# Altium project DE-130817.PrjPcb (part 1 of 2)
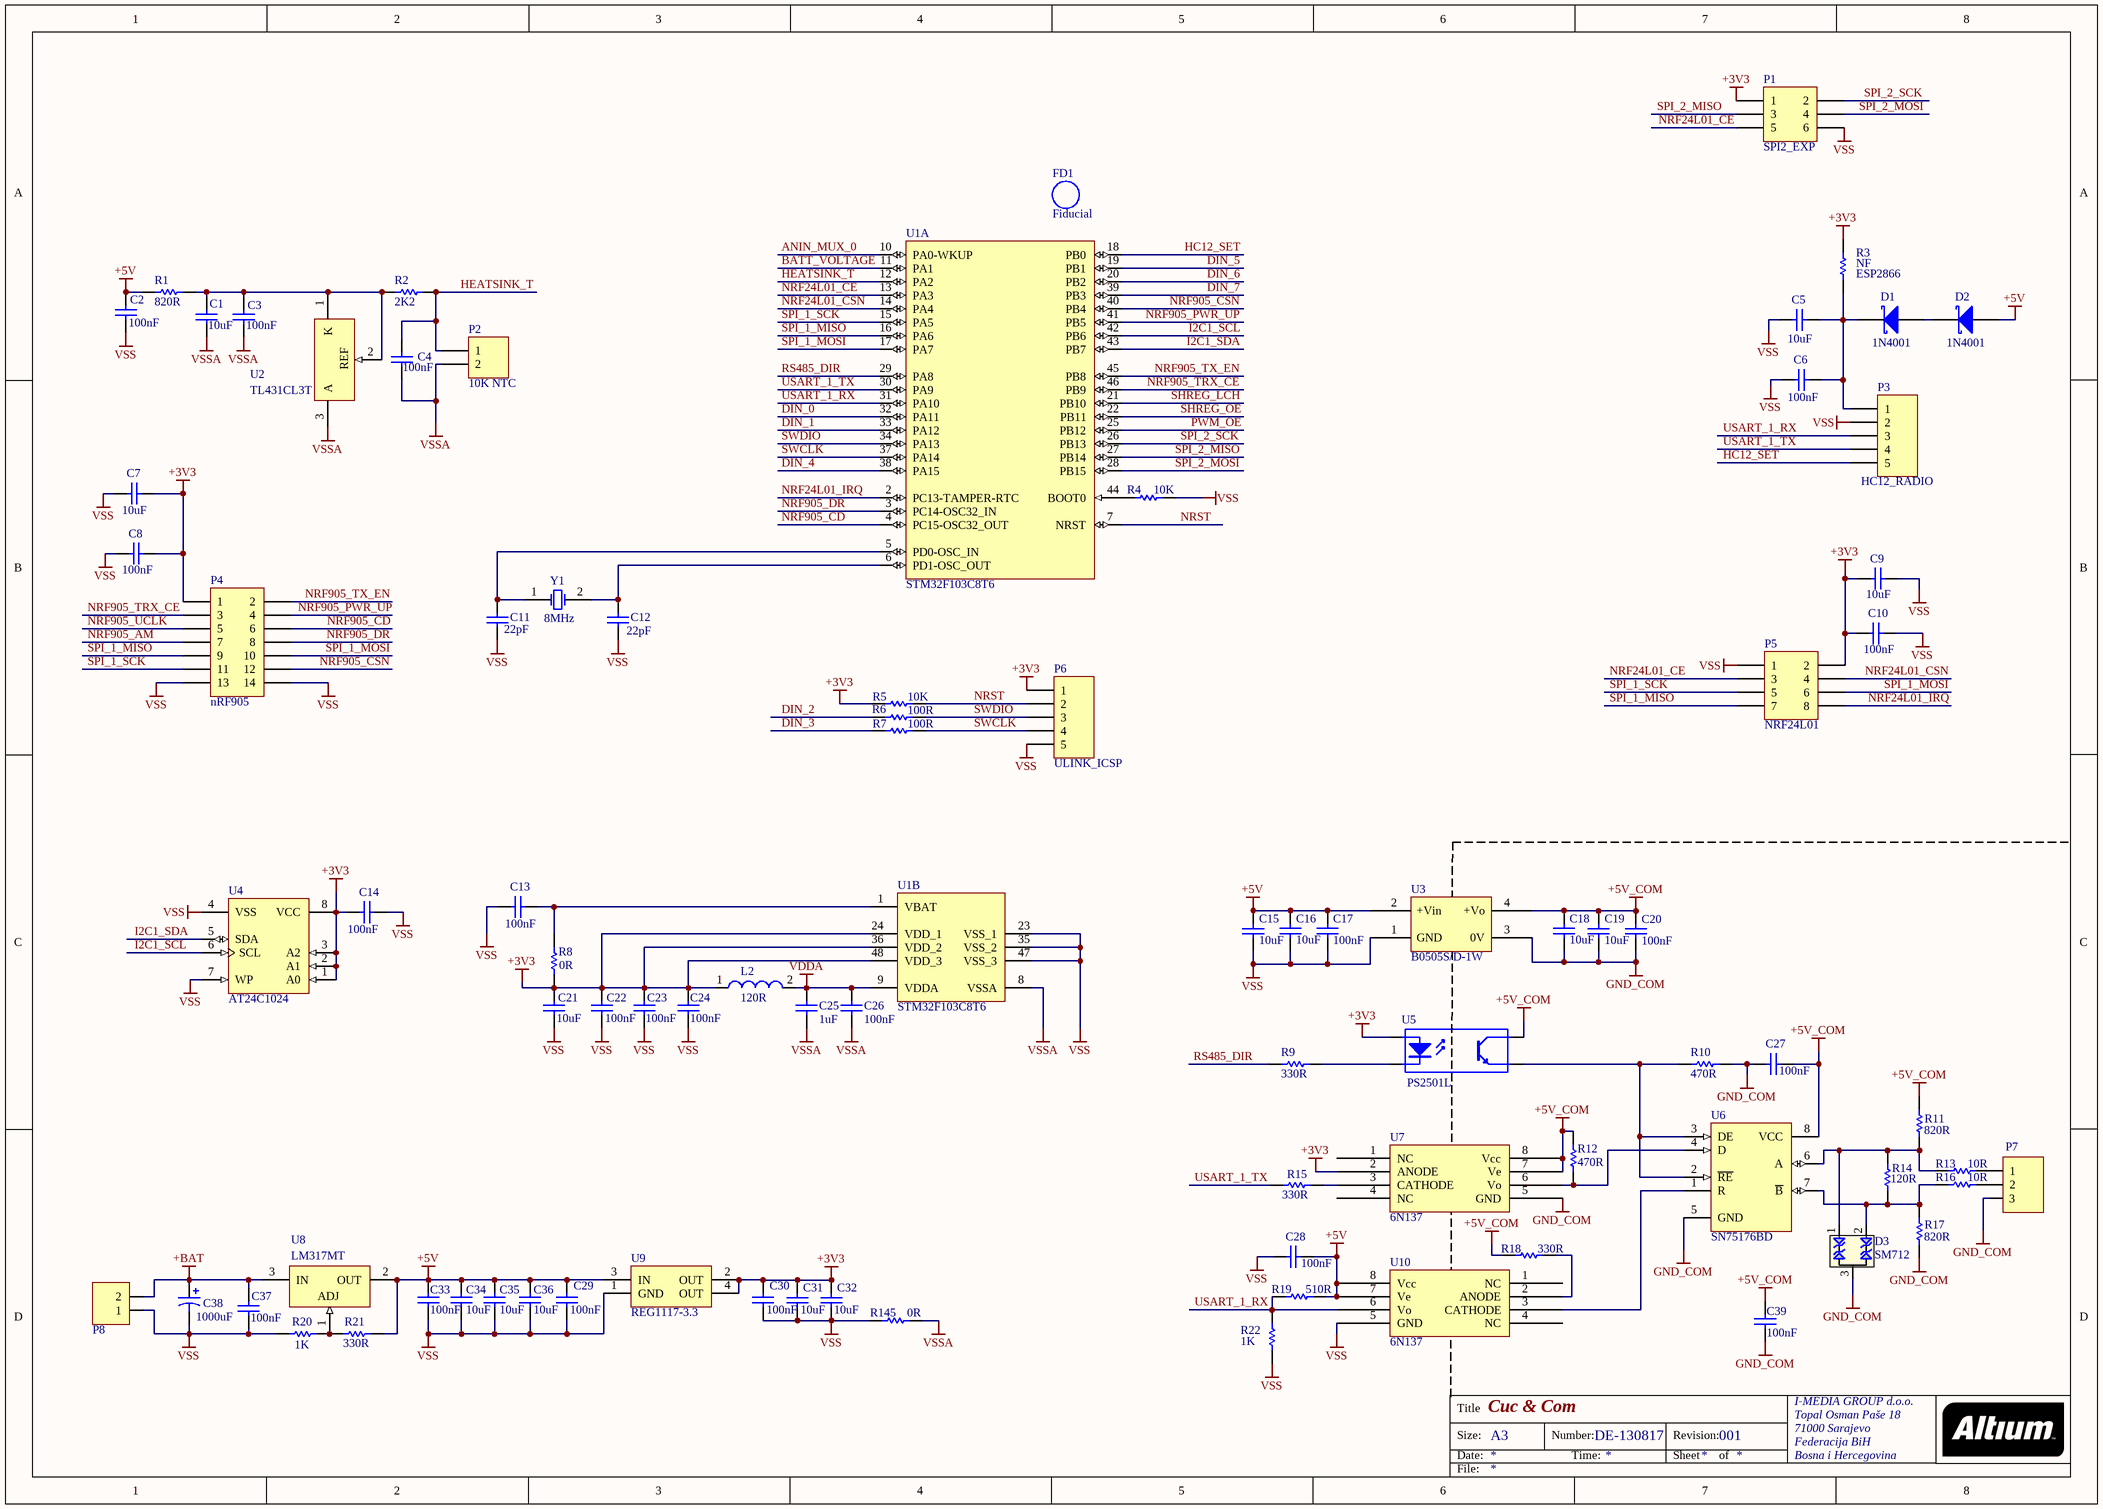
[diagram p0: DE-130817_01.SchDoc]
3 sheets, 405 parts. Net scope: global (net labels, ports and power ports of the same name join across sheets).
Board file: DE-130817.PcbDoc
Sheets:
  DE-130817_01.SchDoc
  DE-130817_02.SchDoc
  DE-130817_03.SchDoc

## Sheet DE-130817_01.SchDoc: Cuc & Com
size A3; Author: eldar6776@hotmail.com; DrawnBy: Eldar Dedic; Organization: I-MEDIA GROUP d.o.o.; Address1: Topal Osman Paše 18; Address2: 71000 Sarajevo; Address3: Federacija BiH; Address4: Bosna i Hercegovina; DocumentNumber: DE-130817; Revision: 001

### Parts
C1  10uF  [0805]
C2  100nF  [0603]
C3  100nF  [0603]
C4  100nF  [0603]
C5  10uF  [0805]
C6  100nF  [0603]
C7  10uF  [0805]
C8  100nF  [0603]
C9  10uF  [0805]
C10  100nF  [0603]
C11  22pF  [0603]
C12  22pF  [0603]
C13  100nF  [0603]
C14  100nF  [0603]
C15  10uF  [0805]
C16  10uF  [0805]
C17  100nF  [0603]
C18  10uF  [0805]
C19  10uF  [0805]
C20  100nF  [0603]
C21  10uF  [0805]
C22  100nF  [0603]
C23  100nF  [0603]
C24  100nF  [0603]
C25  1uF  [0603]
C26  100nF  [0603]
C27  100nF  [0603]
C28  100nF  [0603]
C29  100nF  [0603]
C30  100nF  [0603]
C31  10uF  [0805]
C32  10uF  [0805]
C33  100nF  [0603]
C34  10uF  [0805]
C35  10uF  [0805]
C36  10uF  [0805]
C37  100nF  [0603]
C38  1000uF  [CAPPR5-10x16]
C39  100nF  [0603]
D1  1N4001  [SMA]
D2  1N4001  [SMA]
D3  SM712  [SOT23_3L]
FD1  Fiducial  [Fiducial]  (no BOM)
L2  120R  [SMD-0805]
P1  SPI2_EXP  [HDR2X3]
P2  10K NTC  [HDR1X2]
P3  HC12_RADIO  [HDR1X5]
P4  nRF905  [HDR2X7]
P5  NRF24L01  [HDR2X4]
P6  ULINK_ICSP  [HDR1X5]
P7  TERMINAL BLOK 3  [TERMINAL BLOK 3]  (value not drawn)
P8  TERMINAL BLOK 2  [TERMINAL BLOK 2]  (value not drawn)
R1  820R  [ERA-0603]
R2  2K2  [ERA-0603]
R3  NF  [ERA-0603]
R4  10K  [ERA-0603]
R5  10K  [ERA-0603]
R6  100R  [ERA-0603]
R7  100R  [ERA-0603]
R8  0R  [ERA-0603]
R9  330R  [ERA-0603]
R10  470R  [ERA-0603]
R11  820R  [ERA-0805]
R12  470R  [ERA-0603]
R13  10R  [ERA-0805]
R14  120R  [ERA-0805]
R15  330R  [ERA-0603]
R16  10R  [ERA-0805]
R17  820R  [ERA-0805]
R18  330R  [ERA-0603]
R19  510R  [ERA-0603]
R20  1K  [ERA-0805]
R21  330R  [ERA-0805]
R22  1K  [ERA-0603]
R145  0R  [ERA-0603]
U1  STM32F103C8T6  [STM-LQFP48_N]  (parts A,B of 2)
U2  TL431CL3T  [SOT23-3_N]
U3  B0505S/D-1W  [B0505S-1W]
U4  AT24C1024  [SOIC-SN8_N]
U5  PS2501L  [SOP4]
U6  SN75176BD  [D008_L]
U7  6N137  [SMD-8]
U8  LM317MT  [221A-06]
U9  REG1117-3.3  [ZZ311]
U10  6N137  [SMD-8]
Y1  8MHz  [HC49/4H_SMX]

### Nets
+3V3: C7.1 C8.1 C9.1 C10.1 C14.1 C21.2 C22.2 C23.2 C24.2 C30.2 C31.2 C32.2 L2.1 P1.1 P4.1 P5.2 P6.1 R3.2 R5.2 R8.2 U1.24(VDD_1) U1.36(VDD_2) U1.48(VDD_3) U4.1(A0) U4.2(A1) U4.3(A2) U4.8(VCC) U5.1(A) U7.2(ANODE) U9.2(OUT) U9.4(OUT)
+5V: C2.2 C15.2 C16.2 C17.2 C28.1 C29.2 C33.2 C34.2 C35.2 C36.2 D2.1(A) R1.2 R19.1 R21.1 U3.2(+Vin) U8.2(OUT) U9.3(IN) U10.7(Ve) U10.8(Vcc)
+5V_COM: C18.2 C19.2 C20.2 C27.2 C39.1 R11.2 R12.1 R18.2 U3.4(+Vo) U5.4(C) U6.8(VCC) U7.7(Ve) U7.8(Vcc)
+BAT: C37.2 C38.1 P8.2 U8.3(IN)
GND_COM: C18.1 C19.1 C20.1 C27.1 C39.2 D3.3(GND) P7.3 R10.2 R17.1 U3.3(0V) U6.5(GND) U7.5(GND)
VDDA: C25.2 C26.2 L2.2 U1.9(VDDA)
VSS: C2.1 C5.2 C6.2 C7.2 C8.2 C9.2 C10.2 C11.1 C12.1 C13.2 C14.2 C15.1 C16.1 C17.1 C21.1 C22.1 C23.1 C24.1 C28.2 C29.1 C30.1 C31.1 C32.1 C33.1 C34.1 C35.1 C36.1 C37.1 C38.2 P1.6 P3.2 P4.13 P4.14 P5.1 P6.5 P8.1 R4.2 R20.2 R22.1 R145.1 U1.23(VSS_1) U1.35(VSS_2) U1.47(VSS_3) U3.1(GND) U4.4(VSS) U4.7(WP) U9.1(GND) U10.5(GND)
VSSA: C1.1 C3.1 C4.1 C25.1 C26.1 P2.2 R145.2 U1.8(VSSA) U2.3(A)
ANIN_MUX_0: U1.10(PA0-WKUP)
BATT_VOLTAGE: U1.11(PA1)
DIN_0: U1.32(PA11)
DIN_1: U1.33(PA12)
DIN_2: R6.2
DIN_3: R7.2
DIN_4: U1.38(PA15)
DIN_5: U1.19(PB1)
DIN_6: U1.20(PB2)
DIN_7: U1.39(PB3)
HC12_SET: P3.5 U1.18(PB0)
HEATSINK_T: C4.2 P2.1 R2.1 U1.12(PA2)
I2C1_SCL: U1.42(PB6) U4.6(SCL)
I2C1_SDA: U1.43(PB7) U4.5(SDA)
NRF24L01_CE: P1.5 P5.3 U1.13(PA3)
NRF24L01_CSN: P5.4 U1.14(PA4)
NRF24L01_IRQ: P5.8 U1.2(PC13-TAMPER-RTC)
NRF905_AM: P4.7
NRF905_CD: P4.6 U1.4(PC15-OSC32_OUT)
NRF905_CSN: P4.12 U1.40(PB4)
NRF905_DR: P4.8 U1.3(PC14-OSC32_IN)
NRF905_PWR_UP: P4.4 U1.41(PB5)
NRF905_TRX_CE: P4.3 U1.46(PB9)
NRF905_TX_EN: P4.2 U1.45(PB8)
NRF905_UCLK: P4.5
NRST: P6.2 R5.1 U1.7(NRST)
PWM_OE: U1.25(PB12)
RS485_DIR: R9.2 U1.29(PA8)
SHREG_LCH: U1.21(PB10)
SHREG_OE: U1.22(PB11)
SPI_1_MISO: P4.9 P5.7 U1.16(PA6)
SPI_1_MOSI: P4.10 P5.6 U1.17(PA7)
SPI_1_SCK: P4.11 P5.5 U1.15(PA5)
SPI_2_MISO: P1.3 U1.27(PB14)
SPI_2_MOSI: P1.4 U1.28(PB15)
SPI_2_SCK: P1.2 U1.26(PB13)
SWCLK: P6.4 R7.1 U1.37(PA14)
SWDIO: P6.3 R6.1 U1.34(PA13)
USART_1_RX: P3.3 R19.2 R22.2 U1.31(PA10) U10.6(Vo)
USART_1_TX: P3.4 R15.1 U1.30(PA9)
NetC1_2: C1.2 C3.2 R1.1 R2.2 U2.1(K) U2.2(REF)
NetC5_1: C5.1 C6.1 D1.2(K) P3.1 R3.1
NetC11_2: C11.2 U1.5(PD0-OSC_IN) Y1.1(OSC1)
NetC12_2: C12.2 U1.6(PD1-OSC_OUT) Y1.2(OSC2)
NetC13_1: C13.1 R8.1 U1.1(VBAT)
NetD1_1: D1.1(A) D2.2(K)
NetD3_1: D3.1(I/O) R11.1 R13.1 R14.2 U6.6(A)
NetD3_2: D3.2(I/O) R14.1 R16.1 R17.2 U6.7(~{B})
NetP7_1: P7.1 R13.2
NetP7_2: P7.2 R16.2
NetR4_1: R4.1 U1.44(BOOT0)
NetR9_1: R9.1 U5.2(K)
NetR10_1: R10.1 U5.3(E) U6.2(~{RE}) U6.3(DE)
NetR12_2: R12.2 U6.4(D) U7.6(Vo)
NetR15_2: R15.2 U7.3(CATHODE)
NetR18_1: R18.1 U10.2(ANODE)
NetR20_1: R20.1 R21.2 U8.1(ADJ)
NetU6_1: U6.1(R) U10.3(CATHODE)

Not connected (* = marked no-connect by the designer): U7 1(NC) 4(NC); U10 1(NC) 4(NC)

### Notes on the sheet
- (near R3) ESP2866
- Title
- Size:
- Date:
- A3
- Number:
- Time:
- Revision:
- Sheet
- of
- File:

### Library data of the parts
C1 C5 C7 C9 C15 C16 C18 C19 C21 C31 C32 C34-C36 = C0805: Ceramic Chip Capacitor - Standard; Note: Footprint corresponds to dimensions for bulk cassette packaging. This case size has tightened tolerances.; Published: 17-Jul-2002; LatestRevisionDate: 19-Mar-2004; LatestRevisionNote: Silkscreen size reduced.; DatasheetDocument: Mar-2001; PackageDocument: Mar-2001; PackageReference: 0805; Publisher: Altium Limited; Code_JEITA: 0805; Code_IPC: 2012[0805]; ComponentLink1Description: Manufacturer Link; ComponentLink1URL: http://www.kemet.com/; ComponentLink2Description: Datasheet; ComponentLink2URL: http://www.kemet.com/kemet/web/homepage/kechome.nsf/vapubfilesname/F3102TA.pdf/$file/F3102TA.pdf
  C1 C5 C7 C9 C21: Value: 10uF
C2-C4 C6 C8 C10-C14 C17 C20 C22-C30 C33 C37 C39 = C0603: Ceramic Chip Capacitor - Standard; Note: Footprint corresponds to dimensions for bulk cassette packaging. This case size has tightened tolerances.; Published: 17-Jul-2002; LatestRevisionDate: 19-Mar-2004; LatestRevisionNote: Silkscreen size reduced.; DatasheetDocument: Mar-2001; PackageDocument: Mar-2001; PackageReference: 0603; Publisher: Altium Limited; Code_JEITA: 0603; Code_IPC: 1608 [0603]; ComponentLink1Description: Manufacturer Link; ComponentLink1URL: http://www.kemet.com/; ComponentLink2Description: Datasheet; ComponentLink2URL: http://www.kemet.com/kemet/web/homepage/kechome.nsf/vapubfilesname/F3102TA.pdf/$file/F3102TA.pdf
  C2-C4 C6 C8 C10 C13 C14 C22-C24 C26 C37: Value: 100nF
  C11 C12: Value: 22pF
  C25: Value: 1uF
C38 = EKA00DD410D00: Aluminum Electrolytic Capacitor, Radial Style with Long Leads: 1000uF, 16V; Note: Refer to Manufacturer's Data Sheets for other lead formations; DrillSize: Nominal, Rounded To The Nearest 0.1mm; Published: 19-Mar-2004; DatasheetDocument: 20-Feb-2001; PackageReference: CAPPR5-10X16; Publisher: Altium Limited; ComponentLink1Description: Manufacturer Link; ComponentLink1URL: http://www.vishay.com/; ComponentLink2Description: Datasheet; ComponentLink2URL: http://www.vishay.com/docs/25014/eka.pdf; Value: 1000uF
D1 D2 = 10MQ060N: Schottky Rectifier; Published: 17-Sep-2003; DatasheetVersion: May-2002; PackageVersion: revH, May-2002; PackageReference: SMA; Publisher: Altium Limited; PackageDescription: DO-214-AC/SMA; 2 C-Bend Leads; Body 5 x 2.7 mm, inc. leads (LxW); ComponentLink1Description: Manufacturer Link; ComponentLink1URL: http://www.irf.com/; ComponentLink2Description: Datasheet; ComponentLink2URL: http://www.irf.com/product-info/datasheets/data/10MQ060N.pdf
D3 = 824022: TVS Diode WE-TVS-Standard, VRWM=5.0V; Reverse Stand Off Voltage: 5V; PackageReference: SOT23_3L; PartNumber: 824022; ComponentLink1Description: Manufacturer URL; ComponentLink1URL: http://www.we-online.com; ComponentLink2Description: Datasheet; ComponentLink2URL: http://katalog.we-online.de/kataloge/eisos/media/pdf/824022.pdf
FD1 = Fiduchial: Fiduchial mark
L2 = 74279202: SMD EMI Suppression Ferrite Bead WE-CBF, Z = 120 Ohm; Impedance: 120 Ohm; DatasheetVersion: Dec-2005; PackageReference: SMD-0805; PackageDescription: Chip Inductor, 2-Leads, Body 2.0 x 1.2 mm; PartNumber: 74279202; ComponentLink1Description: Manufacturer URL; ComponentLink1URL: http://www.we-online.com; ComponentLink2Description: Datasheet; ComponentLink2URL: http://www.we-online.de/katalog/media/pdf/74279202.pdf
P1 = Header 3X2: Header, 3-Pin, Dual row; LatestRevisionDate: 17-Jul-2002; LatestRevisionNote: Re-released for DXP Platform.; Publisher: Altium Limited
P2 = Header 2: Header, 2-Pin; LatestRevisionDate: 17-Jul-2002; LatestRevisionNote: Re-released for DXP Platform.; Publisher: Altium Limited
P3 P6 = Header 5: Header, 5-Pin; LatestRevisionDate: 17-Jul-2002; LatestRevisionNote: Re-released for DXP Platform.; Publisher: Altium Limited
P4 = Header 7X2: Header, 7-Pin, Dual row; LatestRevisionDate: 17-Jul-2002; LatestRevisionNote: Re-released for DXP Platform.; Publisher: Altium Limited
P5 = Header 4X2: Header, 4-Pin, Dual row; LatestRevisionDate: 17-Jul-2002; LatestRevisionNote: Re-released for DXP Platform.; Publisher: Altium Limited
P7 = TERMINAL BLOK 3: 3 pinski terminal blok konektor
P8 = TERMINAL BLOK 2: 2 pinski terminal blok
R1-R3 R9 R10 R12 R18 R19 R22 R145 = ERAV: Metal Film Thermosensitive Chip Resistor, 0.56 Ohm to 10k Ohm Range, 5% Tolerance, 0603 Size, 0.063 W; Note: If flow soldering, adjust pad width of PCB Footprint to 0.7 - 0.8 times the width of the resistor.; Published: 17-Dec-2003; LatestRevisionDate: 19-Mar-2004; LatestRevisionNote: Silkscreen size reduced.; PackageDocument: Mar-2003; PackageReference: ERA-0603; Publisher: Altium Limited; Code_IPC: 1608 [0603]; ComponentLink1Description: Manufacturer Link; ComponentLink1URL: http://www.panasonic.com/industrial/components/resistive_products.htm; ComponentLink2Description: Datasheet; ComponentLink2URL: http://www.panasonic.com/industrial/components/pdf/AOF0000CE1.pdf
R4-R8 R15 = ERA3Y: Rectangular Thick Film Chip Resistor, 10 Ohm to 330k Ohm Range, 0.1% and 0.5% Tolerance, 0603 Size, 0.063 W; Note: If flow soldering, adjust pad width of PCB Footprint to 0.7 - 0.8 times the width of the resistor.; Published: 17-Dec-2003; LatestRevisionDate: 19-Mar-2004; LatestRevisionNote: Silkscreen size reduced.; PackageDocument: Mar-2003; PackageReference: ERA-0603; Publisher: Altium Limited; Code_IPC: 1608 [0603]; ComponentLink1Description: Manufacturer Link; ComponentLink1URL: http://www.panasonic.com/industrial/components/resistive_products.htm; ComponentLink2Description: Datasheet; ComponentLink2URL: http://www.panasonic.com/industrial/components/pdf/AOA0000CE8.pdf
  R4 R5: Value: 10K
  R6 R7: Value: 100R
  R8: Value: 0R
  R15: Value: 330R
R11 R13 R14 R16 R17 R20 R21 = ERA6Y: Rectangular Thick Film Chip Resistor, 10 Ohm to 1M Ohm Range, 0.1% and 0.5% Tolerance, 0805 Size, 0.1 W; Note: If flow soldering, adjust pad width of PCB Footprint to 0.7 - 0.8 times the width of the resistor.; Published: 17-Dec-2003; LatestRevisionDate: 19-Mar-2004; LatestRevisionNote: Silkscreen size reduced.; PackageDocument: Mar-2003; PackageReference: ERA-0805; Publisher: Altium Limited; Code_IPC: 2012 [0805]; ComponentLink1Description: Manufacturer Link; ComponentLink1URL: http://www.panasonic.com/industrial/components/resistive_products.htm; ComponentLink2Description: Datasheet; ComponentLink2URL: http://www.panasonic.com/industrial/components/pdf/AOA0000CE8.pdf
  R11 R17: Value: 820R
  R13 R16: Value: 10R
  R14: Value: 120R
  R20: Value: 1K
  R21: Value: 330R
U1 = STM32F103C8T6: ARM Cortex-M3 32-bit MCU, 64 KB Flash, 20 KB Internal RAM, 37 I/Os, 48-pin LQFP, -40 to 85 degC, Tray; A/D Converter: 2x12-bit (10 Channel); FLASH Size (Prog) (kB): 64; I/Os (High Current): 37; Internal RAM Size (kB): 20; Operating Frequency(F) (Processor speed) (MHz): 72; Supply Voltage(Vcc) min (V): 2; DatasheetVersion: Rev. 16; PackageVersion: Rev. 6, 06/2013; PackageReference: LQFP48; PackageDescription: 48-Pin Low Profile Quad Flat Package, 7 x 7 mm Body, 0.5 mm Pitch; Supplier 1: Digi-Key; Supplier Part Number 1: 497-6063-ND; Supplier 2: Farnell; Supplier Part Number 2: 1447637; Supplier 3: Newark; Supplier Part Number 3: 59M2182; Supplier 4: Newark; Supplier Part Number 4: 57P1222; Supplier 5: Mouser; Supplier Part Number 5: 511-STM32F103C8T6; Core: ARM Cortex-M3; Packing: Tray; Mounting Technology: Surface Mount; PartNumber: STM32F103C8T6; ComponentLink1Description: Manufacturer URL; ComponentLink1URL: http://www.st.com/web/en/home.html; ComponentLink2Description: Datasheet; ComponentLink2URL: http://www.st.com/st-web-ui/static/active/en/resource/technical/document/datasheet/CD00161566.pdf; ComponentLink3Description: Package Specification; ComponentLink3URL: http://www.st.com/st-web-ui/static/active/en/resource/technical/document/datasheet/DM00058181.pdf
U2 = TL431CL3T: Programmable Voltage Reference, 2.5 to 36V, 3-Pin SOT23-3, Tape and Reel; DatasheetVersion: Oct-2011; PackageVersion: 2011; PackageReference: SOT23-3; PackageDescription: 3-Pin SOT-23 Package 0.95 mm Pitch, 2.4 mm Lead Span; ComponentLink1Description: Manufacturer URL; ComponentLink1URL: http://www.st.com; ComponentLink2Description: Datasheet; ComponentLink2URL: http://www.st.com/internet/com/TECHNICAL_RESOURCES/TECHNICAL_LITERATURE/DATASHEET/CD00000986.pdf
U3 = B0505S/D: 1W isolated dc dc converter
U4 = 24AA64/SN: 64Kbit, 400kHz, 1.7V, I2C Serial EEPROM, 8-Pin SOIC 150mil, Commercial Temperature; Published: 29-Jan-2009; DatasheetVersion: revQ, Jun-2009; PackageVersion: revBB, Aug-2009; PackageReference: SOIC-SN8; Publisher: Altium Limited; PackageDescription: 8-Lead Plastic Small Outline (SN) - Narrow, 3.90mm Body [SOIC]; Supplier 1: Digi-Key; Supplier Part Number 1: 24AA64/SN-ND; Code_JEDEC: MS-012; Code_IPC: SOIC127P600-8; ComponentLink1Description: Datasheet; ComponentLink1URL: http://ww1.microchip.com/downloads/en/DeviceDoc/21189Q.pdf; ComponentLink2Description: Packaging Specification; ComponentLink2URL: http://www.microchip.com/stellent/groups/techpub_sg/documents/packagingspec/en012702.pdf; ComponentLink3Description: Microchip.com Home; ComponentLink3URL: http://www.microchip.com/
U5 = PC817 optocoupler: 4-Pin Phototransistor Optocoupler; Published: 24-Mar-1999; LatestRevisionDate: 04-Mar-2005; LatestRevisionNote: Sch pins 3 & 4 Swapped.; DatasheetVersion: Nov-2003; PackageReference: DIP-4; Publisher: Altium Limited
U6 = SN75176BD: Differential Bus Transceiver; Note: Receiver Hysteresis of 50mV Typical; Published: 15-May-2002; LatestRevisionDate: 13-Apr-2006; LatestRevisionNote: IPC-7351 Footprint Added.; DatasheetVersion: Sep-1989; PackageVersion: Jan-1998; PackageReference: D008; Publisher: Altium Limited; PackageDescription: 8-Pin Small Outline Integrated Circuit 1.27 mm Pitch; Code_IPC: SOIC127P600-8; ComponentLink1Description: Manufacturer Link; ComponentLink1URL: http://www.ti.com/; ComponentLink2Description: Datasheet; ComponentLink2URL: http://www-s.ti.com/sc/ds/sn75176b.pdf
U7 U10 = 6N137: High CMR, High Speed TTL Compatibile Optocoupler
U8 = LM317MT: Three-Terminal Adjustable Output Positive Voltage Regulator; Note: Heatsink surface connected to Pin 2; Published: 15-Apr-2002; DatasheetVersion: Nov-1999; PackageVersion: 1997; PackageReference: 221A-06; Publisher: Altium Limited; PackageDescription: TO, Thru-Hole, Vertical, Heatsink Mounted; 3 In-Line Leads; Pitch 2.54 mm; Code_JEDEC: TO-262-AA; ComponentLink1Description: Manufacturer Link; ComponentLink1URL: http://www.onsemi.com/site/products/taxonomy/0,4438,503,00.html; ComponentLink2Description: Datasheet; ComponentLink2URL: http://www.onsemi.com/pub/Collateral/LM317M-D.PDF
U9 = REG1117-3.3: 800mA and 1A Low Dropout Positive Regulator 2.85V, 3.3V, 5V, and Adjustable; Published: 8-Jun-2000; LatestRevisionDate: 17-Jul-2002; LatestRevisionNote: Re-released for DXP Platform.; DatasheetVersion: Sep-1997; PackageVersion: revC; PackageReference: ZZ311; Publisher: Altium Limited; PackageDescription: SOT-223/SC-73; 4 Leads; Body 6.7 x 7.3 mm, inc. leads (LxW max); ComponentLink1Description: Manufacturer Link; ComponentLink1URL: http://www.ti.com/; ComponentLink2Description: Datasheet; ComponentLink2URL: http://www-s.ti.com/sc/ds/REG1117.pdf
Y1 = HC49/4H_SMX: Surface Mount Quartz Crystal; Note: PCB layout complies with manufacturer's recommendation.; Published: 17-Jul-2002; DatasheetDocument: 18-Oct-1999; PackageDocument: 18-Oct-1999; PackageReference: HC49/4H_SMX; Publisher: Altium Limited; ComponentLink1Description: Manufacturer Link; ComponentLink1URL: http://www.cmac.com/mt/; ComponentLink2Description: Datasheet; ComponentLink2URL: http://www.cmac.com/mt/databook/crystals/smd/hc49_4h_smx.pdf

## Sheet DE-130817_02.SchDoc: Digital Input & Relay Out
size A3; Author: eldar6776@hotmail.com; DrawnBy: Eldar Dedic; Organization: I-MEDIA GROUP d.o.o.; Address1: Topal Osman Paše 18; Address2: 71000 Sarajevo; Address3: Federacija BiH; Address4: Bosna i Hercegovina; DocumentNumber: DE-130817; Revision: 001
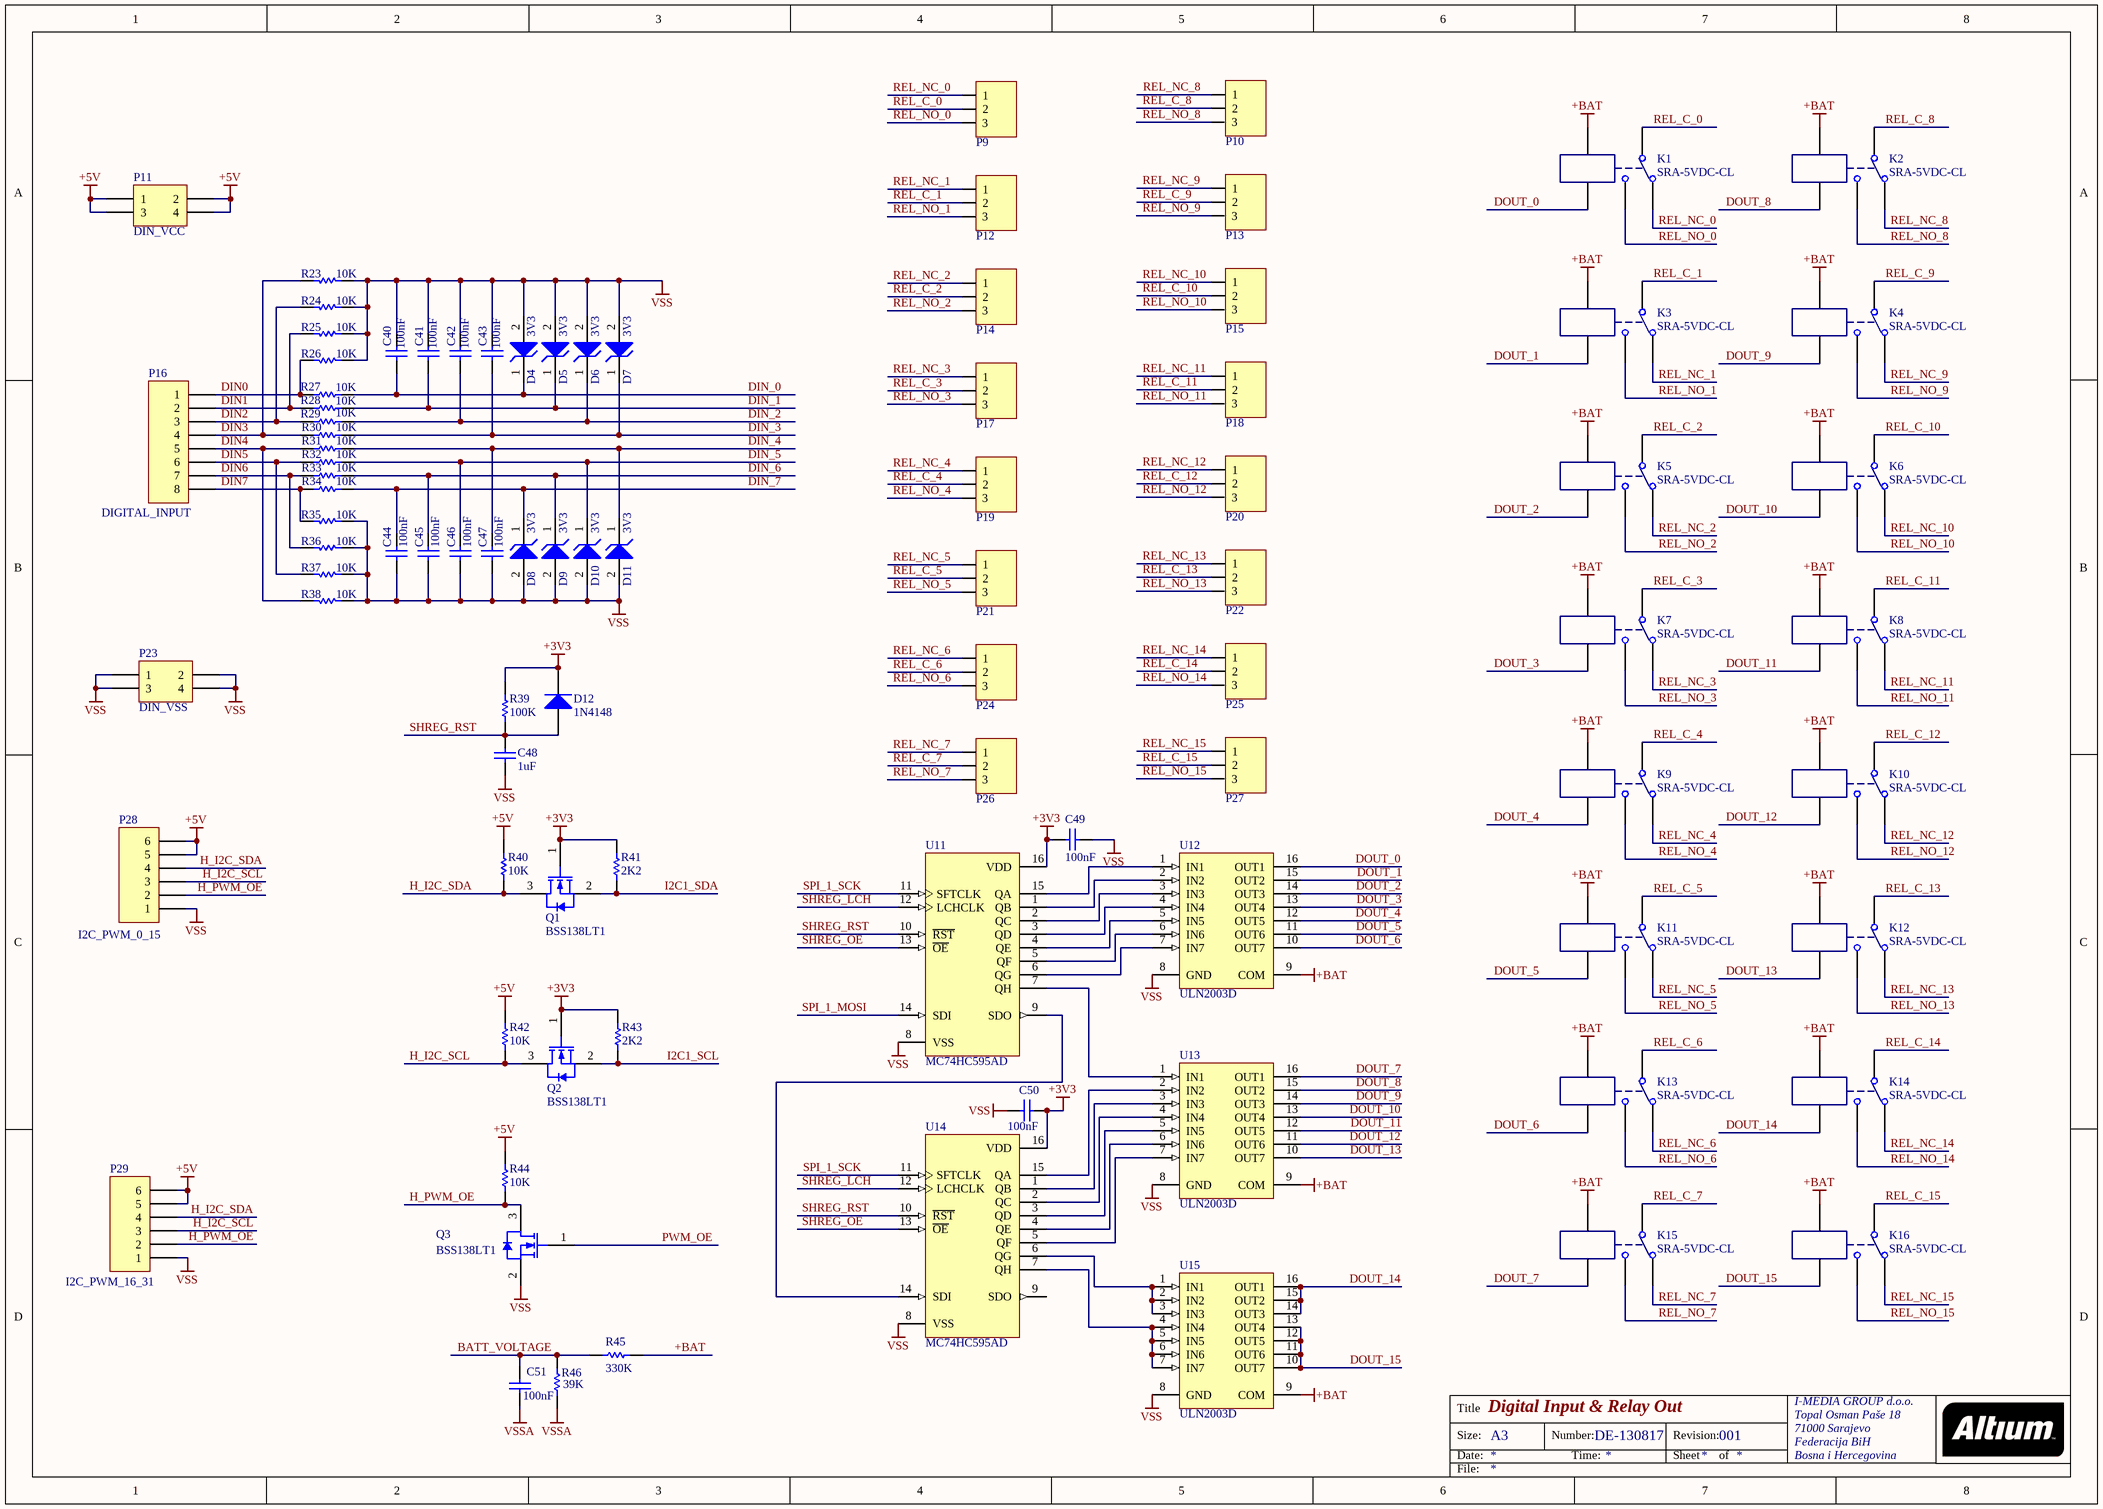
[diagram p1: DE-130817_02.SchDoc]

### Parts
C40  100nF  [0603]
C41  100nF  [0603]
C42  100nF  [0603]
C43  100nF  [0603]
C44  100nF  [0603]
C45  100nF  [0603]
C46  100nF  [0603]
C47  100nF  [0603]
C48  1uF  [0603]
C49  100nF  [0603]
C50  100nF  [0603]
C51  100nF  [0603]
D4  3V3  [ONSC-SOD-323-2-477-02_V]
D5  3V3  [ONSC-SOD-323-2-477-02_V]
D6  3V3  [ONSC-SOD-323-2-477-02_V]
D7  3V3  [ONSC-SOD-323-2-477-02_V]
D8  3V3  [ONSC-SOD-323-2-477-02_V]
D9  3V3  [ONSC-SOD-323-2-477-02_V]
D10  3V3  [ONSC-SOD-323-2-477-02_V]
D11  3V3  [ONSC-SOD-323-2-477-02_V]
D12  1N4148  [SOD323]
K1  SRA-5VDC-CL  [SRA-5VDC-CL]
K2  SRA-5VDC-CL  [SRA-5VDC-CL]
K3  SRA-5VDC-CL  [SRA-5VDC-CL]
K4  SRA-5VDC-CL  [SRA-5VDC-CL]
K5  SRA-5VDC-CL  [SRA-5VDC-CL]
K6  SRA-5VDC-CL  [SRA-5VDC-CL]
K7  SRA-5VDC-CL  [SRA-5VDC-CL]
K8  SRA-5VDC-CL  [SRA-5VDC-CL]
K9  SRA-5VDC-CL  [SRA-5VDC-CL]
K10  SRA-5VDC-CL  [SRA-5VDC-CL]
K11  SRA-5VDC-CL  [SRA-5VDC-CL]
K12  SRA-5VDC-CL  [SRA-5VDC-CL]
K13  SRA-5VDC-CL  [SRA-5VDC-CL]
K14  SRA-5VDC-CL  [SRA-5VDC-CL]
K15  SRA-5VDC-CL  [SRA-5VDC-CL]
K16  SRA-5VDC-CL  [SRA-5VDC-CL]
P9  TERMINAL BLOK 3  [TERMINAL BLOK 3]  (value not drawn)
P10  TERMINAL BLOK 3  [TERMINAL BLOK 3]  (value not drawn)
P11  DIN_VCC  [HDR2X2]
P12  TERMINAL BLOK 3  [TERMINAL BLOK 3]  (value not drawn)
P13  TERMINAL BLOK 3  [TERMINAL BLOK 3]  (value not drawn)
P14  TERMINAL BLOK 3  [TERMINAL BLOK 3]  (value not drawn)
P15  TERMINAL BLOK 3  [TERMINAL BLOK 3]  (value not drawn)
P16  DIGITAL_INPUT  [HDR1X8]
P17  TERMINAL BLOK 3  [TERMINAL BLOK 3]  (value not drawn)
P18  TERMINAL BLOK 3  [TERMINAL BLOK 3]  (value not drawn)
P19  TERMINAL BLOK 3  [TERMINAL BLOK 3]  (value not drawn)
P20  TERMINAL BLOK 3  [TERMINAL BLOK 3]  (value not drawn)
P21  TERMINAL BLOK 3  [TERMINAL BLOK 3]  (value not drawn)
P22  TERMINAL BLOK 3  [TERMINAL BLOK 3]  (value not drawn)
P23  DIN_VSS  [HDR2X2]
P24  TERMINAL BLOK 3  [TERMINAL BLOK 3]  (value not drawn)
P25  TERMINAL BLOK 3  [TERMINAL BLOK 3]  (value not drawn)
P26  TERMINAL BLOK 3  [TERMINAL BLOK 3]  (value not drawn)
P27  TERMINAL BLOK 3  [TERMINAL BLOK 3]  (value not drawn)
P28  I2C_PWM_0_15  [HDR1X6]
P29  I2C_PWM_16_31  [HDR1X6]
Q1  BSS138LT1  [ONSC-SOT-23-3-318-08_V]
Q2  BSS138LT1  [ONSC-SOT-23-3-318-08_V]
Q3  BSS138LT1  [ONSC-SOT-23-3-318-08_V]
R23  10K  [ERA-0603]
R24  10K  [ERA-0603]
R25  10K  [ERA-0603]
R26  10K  [ERA-0603]
R27  10K  [ERA-0603]
R28  10K  [ERA-0603]
R29  10K  [ERA-0603]
R30  10K  [ERA-0603]
R31  10K  [ERA-0603]
R32  10K  [ERA-0603]
R33  10K  [ERA-0603]
R34  10K  [ERA-0603]
R35  10K  [ERA-0603]
R36  10K  [ERA-0603]
R37  10K  [ERA-0603]
R38  10K  [ERA-0603]
R39  100K  [ERA-0603]
R40  10K  [ERA-0603]
R41  2K2  [ERA-0603]
R42  10K  [ERA-0603]
R43  2K2  [ERA-0603]
R44  10K  [ERA-0603]
R45  330K  [ERA-0603]
R46  39K  [ERA-0603]
U11  MC74HC595AD  [751B-05_N]
U12  ULN2003D  [SO16_N]
U13  ULN2003D  [SO16_N]
U14  MC74HC595AD  [751B-05_N]
U15  ULN2003D  [SO16_N]

### Nets
+3V3: C49.2 C50.2 D12.1(K) Q1.1(G) Q2.1(G) R39.2 R41.2 R43.2 U11.16(VDD) U14.16(VDD)
+5V: P11.1 P11.2 P11.3 P11.4 P28.5 P28.6 P29.5 P29.6 R40.2 R42.2 R44.2
+BAT: K1.2 K2.2 K3.2 K4.2 K5.2 K6.2 K7.2 K8.2 K9.2 K10.2 K11.2 K12.2 K13.2 K14.2 K15.2 K16.2 R45.2 U12.9(COM) U13.9(COM) U15.9(COM)
VSS: C40.1 C41.1 C42.1 C43.1 C44.1 C45.1 C46.1 C47.1 C48.1 C49.1 C50.1 D4.2(A) D5.2(A) D6.2(A) D7.2(A) D8.2(A) D9.2(A) D10.2(A) D11.2(A) P23.1 P23.2 P23.3 P23.4 P28.1 P29.1 Q3.2(S) R23.1 R24.1 R25.1 R26.1 R35.1 R36.1 R37.1 R38.1 U11.8(VSS) U12.8(GND) U13.8(GND) U14.8(VSS) U15.8(GND)
VSSA: C51.1 R46.1
BATT_VOLTAGE: C51.2 R45.1 R46.2
DIN0: P16.1 R26.2 R27.1
DIN1: P16.2 R25.2 R28.1
DIN2: P16.3 R24.2 R29.1
DIN3: P16.4 R23.2 R30.1
DIN4: P16.5 R31.1 R38.2
DIN5: P16.6 R32.1 R37.2
DIN6: P16.7 R33.1 R36.2
DIN7: P16.8 R34.1 R35.2
DIN_0: C40.2 D4.1(K) R27.2
DIN_1: C41.2 D5.1(K) R28.2
DIN_2: C42.2 D6.1(K) R29.2
DIN_3: C43.2 D7.1(K) R30.2
DIN_4: C47.2 D11.1(K) R31.2
DIN_5: C46.2 D10.1(K) R32.2
DIN_6: C45.2 D9.1(K) R33.2
DIN_7: C44.2 D8.1(K) R34.2
DOUT_0: K1.5 U12.16(OUT1)
DOUT_1: K3.5 U12.15(OUT2)
DOUT_2: K5.5 U12.14(OUT3)
DOUT_3: K7.5 U12.13(OUT4)
DOUT_4: K9.5 U12.12(OUT5)
DOUT_5: K11.5 U12.11(OUT6)
DOUT_6: K13.5 U12.10(OUT7)
DOUT_7: K15.5 U13.16(OUT1)
DOUT_8: K2.5 U13.15(OUT2)
DOUT_9: K4.5 U13.14(OUT3)
DOUT_10: K6.5 U13.13(OUT4)
DOUT_11: K8.5 U13.12(OUT5)
DOUT_12: K10.5 U13.11(OUT6)
DOUT_13: K12.5 U13.10(OUT7)
DOUT_14: K14.5 U15.14(OUT3) U15.15(OUT2) U15.16(OUT1)
DOUT_15: K16.5 U15.10(OUT7) U15.11(OUT6) U15.12(OUT5) U15.13(OUT4)
H_I2C_SCL: P28.3 P29.3 Q2.3(D) R42.1
H_I2C_SDA: P28.4 P29.4 Q1.3(D) R40.1
H_PWM_OE: P28.2 P29.2 Q3.3(D) R44.1
I2C1_SCL: Q2.2(S) R43.1
I2C1_SDA: Q1.2(S) R41.1
PWM_OE: Q3.1(G)
REL_C_0: K1.1 P9.2
REL_C_1: K3.1 P12.2
REL_C_2: K5.1 P14.2
REL_C_3: K7.1 P17.2
REL_C_4: K9.1 P19.2
REL_C_5: K11.1 P21.2
REL_C_6: K13.1 P24.2
REL_C_7: K15.1 P26.2
REL_C_8: K2.1 P10.2
REL_C_9: K4.1 P13.2
REL_C_10: K6.1 P15.2
REL_C_11: K8.1 P18.2
REL_C_12: K10.1 P20.2
REL_C_13: K12.1 P22.2
REL_C_14: K14.1 P25.2
REL_C_15: K16.1 P27.2
REL_NC_0: K1.4 P9.1
REL_NC_1: K3.4 P12.1
REL_NC_2: K5.4 P14.1
REL_NC_3: K7.4 P17.1
REL_NC_4: K9.4 P19.1
REL_NC_5: K11.4 P21.1
REL_NC_6: K13.4 P24.1
REL_NC_7: K15.4 P26.1
REL_NC_8: K2.4 P10.1
REL_NC_9: K4.4 P13.1
REL_NC_10: K6.4 P15.1
REL_NC_11: K8.4 P18.1
REL_NC_12: K10.4 P20.1
REL_NC_13: K12.4 P22.1
REL_NC_14: K14.4 P25.1
REL_NC_15: K16.4 P27.1
REL_NO_0: K1.3 P9.3
REL_NO_1: K3.3 P12.3
REL_NO_2: K5.3 P14.3
REL_NO_3: K7.3 P17.3
REL_NO_4: K9.3 P19.3
REL_NO_5: K11.3 P21.3
REL_NO_6: K13.3 P24.3
REL_NO_7: K15.3 P26.3
REL_NO_8: K2.3 P10.3
REL_NO_9: K4.3 P13.3
REL_NO_10: K6.3 P15.3
REL_NO_11: K8.3 P18.3
REL_NO_12: K10.3 P20.3
REL_NO_13: K12.3 P22.3
REL_NO_14: K14.3 P25.3
REL_NO_15: K16.3 P27.3
SHREG_LCH: U11.12(LCHCLK) U14.12(LCHCLK)
SHREG_OE: U11.13(~{OE}) U14.13(~{OE})
SHREG_RST: C48.2 D12.2(A) R39.1 U11.10(~{RST}) U14.10(~{RST})
SPI_1_MOSI: U11.14(SDI)
SPI_1_SCK: U11.11(SFTCLK) U14.11(SFTCLK)
NetU11_1: U11.1(QB) U12.2(IN2)
NetU11_2: U11.2(QC) U12.3(IN3)
NetU11_3: U11.3(QD) U12.4(IN4)
NetU11_4: U11.4(QE) U12.5(IN5)
NetU11_5: U11.5(QF) U12.6(IN6)
NetU11_6: U11.6(QG) U12.7(IN7)
NetU11_7: U11.7(QH) U13.1(IN1)
NetU11_9: U11.9(SDO) U14.14(SDI)
NetU11_15: U11.15(QA) U12.1(IN1)
NetU13_2: U13.2(IN2) U14.15(QA)
NetU13_3: U13.3(IN3) U14.1(QB)
NetU13_4: U13.4(IN4) U14.2(QC)
NetU13_5: U13.5(IN5) U14.3(QD)
NetU13_6: U13.6(IN6) U14.4(QE)
NetU13_7: U13.7(IN7) U14.5(QF)
NetU14_6: U14.6(QG) U15.1(IN1) U15.2(IN2) U15.3(IN3)
NetU14_7: U14.7(QH) U15.4(IN4) U15.5(IN5) U15.6(IN6) U15.7(IN7)

Not connected (* = marked no-connect by the designer): U14 9(SDO)

### Notes on the sheet
- Title
- Size:
- Date:
- A3
- Number:
- Time:
- Revision:
- Sheet
- of
- File:

### Library data of the parts
C40-C51 = C0603: as C2 on sheet DE-130817_01; Published: 17-Jul-2002; LatestRevisionDate: 19-Mar-2004; LatestRevisionNote: Silkscreen size reduced.; DatasheetDocument: Mar-2001; PackageDocument: Mar-2001; PackageReference: 0603; Publisher: Altium Limited; Code_JEITA: 0603; Code_IPC: 1608 [0603]; ComponentLink1Description: Manufacturer Link; ComponentLink1URL: http://www.kemet.com/; ComponentLink2Description: Datasheet; ComponentLink2URL: http://www.kemet.com/kemet/web/homepage/kechome.nsf/vapubfilesname/F3102TA.pdf/$file/F3102TA.pdf
D4-D11 = MM3Z33VT1G: Zener Voltage Regulator, 300 mW, 2-Pin SOD-323, Pb-Free, Tape and Reel; Manufacturer: On Semiconductor; P Max (W): 0.3; VZ Typ (V): 33; DatasheetVersion: Rev. 9; PackageVersion: Rev. H, 03/2007; PackageReference: SOD-323-2-477-02; PackageDescription: 2-Pin SOD, Body 1.7 x 1.25 mm; Supplier 1: Digi-Key; Supplier Part Number 1: MM3Z33VT1GOSTR-ND; Supplier 2: Digi-Key; Supplier Part Number 2: MM3Z33VT1GOSCT-ND; Supplier 3: Digi-Key; Supplier Part Number 3: MM3Z33VT1GOSDKR-ND; Supplier 4: Farnell; Supplier Part Number 4: 1431197RL; Supplier 5: Farnell; Supplier Part Number 5: 1431197; Supplier 6: Newark; Supplier Part Number 6: 98H0837; Supplier 7: Mouser; Supplier Part Number 7: 863-MM3Z33VT1G; Packing: Tape and Reel; RoHS: Pb-Free; Mounting Technology: Surface Mount; PartNumber: MM3Z33VT1G; ComponentLink1Description: Manufacturer URL; ComponentLink1URL: http://www.onsemi.com/; ComponentLink2Description: Datasheet; ComponentLink2URL: http://www.onsemi.cn/pub_link/Collateral/MM3Z2V4T1-D.PDF; ComponentLink3Description: Package Specification; ComponentLink3URL: http://www.onsemi.com/pub_link/Collateral/477-02.PDF.1
D12 = BAS321: General-purpose Diode; Published: 17-Sep-2003; LatestRevisionDate: 19-Mar-2004; LatestRevisionNote: Silkscreen size reduced.; DatasheetVersion: 9-Feb-1999; PackageVersion: May-1999; PackageReference: SOD323; Publisher: Altium Limited; PackageDescription: SOD-323/SC-76; 2 Leads; Body 1.7 x 1.3 mm, (LxW); ComponentLink1Description: Manufacturer Link; ComponentLink1URL: http://www.semiconductors.philips.com/; ComponentLink2Description: Datasheet; ComponentLink2URL: http://www.semiconductors.philips.com/acrobat/datasheets/BAS321_2.pdf
K1-K16 = SRA-5VDC-CL: SPDT PCB relay 5Vdc coil
P9 P10 P12-P15 P17-P22 P24-P27 = TERMINAL BLOK 3: 3 pinski terminal blok konektor
P11 P23 = Header 2X2: Header, 2-Pin, Dual row; LatestRevisionDate: 17-Jul-2002; LatestRevisionNote: Re-released for DXP Platform.; Publisher: Altium Limited
P16 = Header 8: Header, 8-Pin; LatestRevisionDate: 17-Jul-2002; LatestRevisionNote: Re-released for DXP Platform.; Publisher: Altium Limited
P28 P29 = Header 6: Header, 6-Pin; LatestRevisionDate: 17-Jul-2002; LatestRevisionNote: Re-released for DXP Platform.; Publisher: Altium Limited
Q1-Q3 = BSS138LT1: Power MOSFET, 200 mA, 50 V, N-Channel, 3-Pin SOT-23, Tape and Reel; Manufacturer: On Semiconductor; Channel Polarity: N Channel; Ciss Typ (pF): 40; Configuration: Single; Coss Typ (pF): 12; Crss Typ (pF): 3.5; ID Max (A): 0.2; PD Max (W): 0.225; V(BR)DSS Min (V): 50; VGS Max (V): 20; VGS(th) Max (V): 1.5; DatasheetVersion: Rev. 8; PackageVersion: Rev. AP, 11/2009; PackageReference: SOT-23-3-318-08; PackageDescription: 3-Pin Small Outline Transistor, Body 2.92 x 1.3 mm, Pitch 0.95 mm; Supplier 1: Digi-Key; Supplier Part Number 1: BSS138LT1OSCT-ND; Package Type: SOT-23-3; Packing: Tape and Reel; Mounting Technology: Surface Mount; PartNumber: BSS138LT1; ComponentLink1Description: Manufacturer URL; ComponentLink1URL: http://www.onsemi.com/; ComponentLink2Description: Datasheet; ComponentLink2URL: http://www.onsemi.com/pub_link/Collateral/BSS138LT1-D.PDF; ComponentLink3Description: Package Specification; ComponentLink3URL: http://www.onsemi.cn/pub_link/Collateral/318-08.PDF
R23-R46 = ERAV: as R1 on sheet DE-130817_01; Published: 17-Dec-2003; LatestRevisionDate: 19-Mar-2004; LatestRevisionNote: Silkscreen size reduced.; PackageDocument: Mar-2003; PackageReference: ERA-0603; Publisher: Altium Limited; Code_IPC: 1608 [0603]; ComponentLink1Description: Manufacturer Link; ComponentLink1URL: http://www.panasonic.com/industrial/components/resistive_products.htm; ComponentLink2Description: Datasheet; ComponentLink2URL: http://www.panasonic.com/industrial/components/pdf/AOF0000CE1.pdf
U11 U14 = MC74HC595AD: 8-Bit Serial-Input/Serial or Prallel-Output Shift Register with Latched 3-State Outputs; Published: 15-Apr-2002; LatestRevisionDate: 13-Apr-2006; LatestRevisionNote: IPC-7351 Footprint Added.; DatasheetVersion: Mar-2000; PackageVersion: Oct-1999; PackageReference: 751B-05; Publisher: Altium Limited; PackageDescription: 16-Pin Small Outline Integrated Circuit 1.27 mm Pitch; Code_JEDEC: MS-012-AC; Code_IPC: SOIC127P600-16; ComponentLink1Description: Manufacturer Link; ComponentLink1URL: http://www.onsemi.com/; ComponentLink2Description: Datasheet; ComponentLink2URL: http://www.onsemi.com/pub/Collateral/MC74HC595A-D.PDF
U12 U13 U15 = ULN2003D: Seven Darlington Array; Published: 8-Jun-2000; LatestRevisionDate: 13-Apr-2006; LatestRevisionNote: IPC-7351 Footprint Added.; DatasheetVersion: Sep-1998; PackageVersion: May-1998; PackageReference: SO16; Publisher: Altium Limited; PackageDescription: 16-Pin Small Outline Integrated Circuit 1.27 mm Pitch; Code_IPC: SOIC127P600-16; ComponentLink1Description: Manufacturer Link; ComponentLink1URL: http://www.st.com/; ComponentLink2Description: Datasheet; ComponentLink2URL: http://www.st.com/stonline/products/literature/ds/5279/uln2001.pdf